# Altium schematic sheet Z7_ETHERNET.SchDoc
size A2
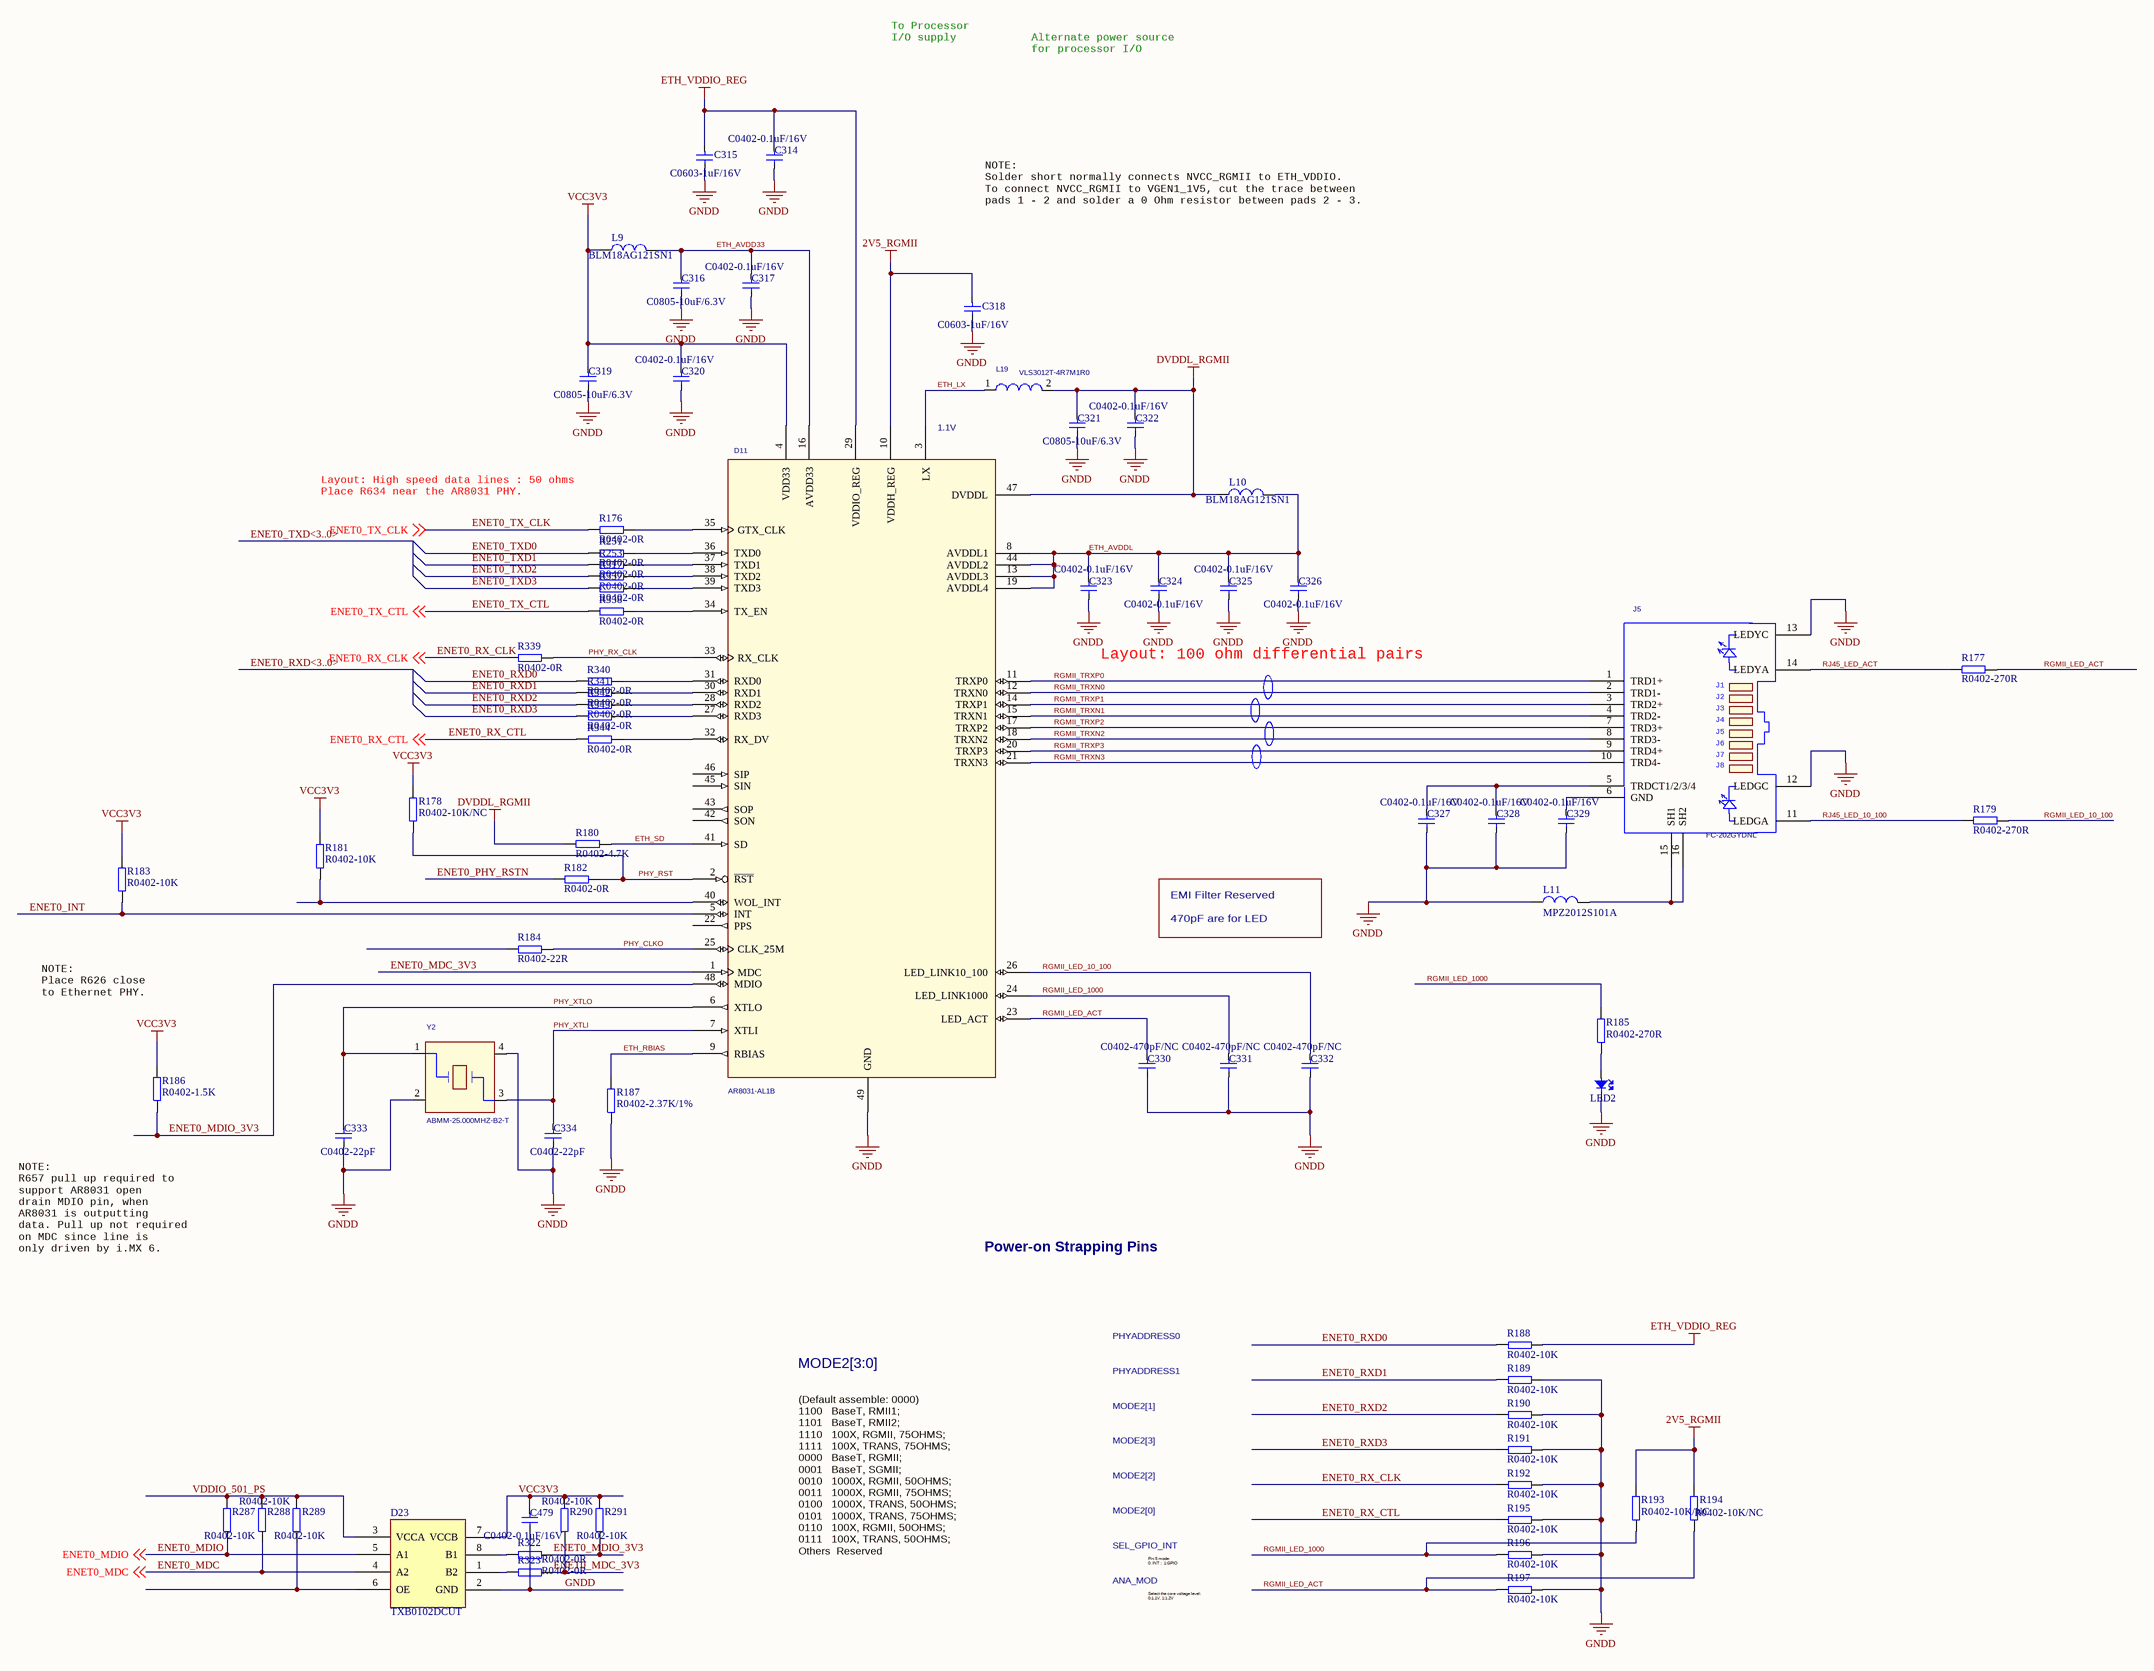
[diagram p0: Z7_ETHERNET.SchDoc]

## Parts
C314  C0402-0.1uF/16V  [C0402]
C315  C0603-1uF/16V  [C0603]
C316  C0805-10uF/6.3V  [C0805]
C317  C0402-0.1uF/16V  [C0402]
C318  C0603-1uF/16V  [C0603]
C319  C0805-10uF/6.3V  [C0805]
C320  C0402-0.1uF/16V  [C0402]
C321  C0805-10uF/6.3V  [C0805]
C322  C0402-0.1uF/16V  [C0402]
C323  C0402-0.1uF/16V  [C0402]
C324  C0402-0.1uF/16V  [C0402]
C325  C0402-0.1uF/16V  [C0402]
C326  C0402-0.1uF/16V  [C0402]
C327  C0402-0.1uF/16V  [C0402]
C328  C0402-0.1uF/16V  [C0402]
C329  C0402-0.1uF/16V  [C0402]
C330  C0402-470pF/NC  [C0402]
C331  C0402-470pF/NC  [C0402]
C332  C0402-470pF/NC  [C0402]
C333  C0402-22pF  [C0402]
C334  C0402-22pF  [C0402]
C479  C0402-0.1uF/16V  [C0402]
D11  AR8031-AL1B  [QFN-48N]
D23  TXB0102DCUT  [MSOP-8]
J5  FC-202GYDNL  [RJ45-1840710]
L9  BLM18AG121SN1  [R0603]
L10  BLM18AG121SN1  [R0603]
L11  MPZ2012S101A  [R0805]
L19  VLS3012T-4R7M1R0  [GTSD32P]
LED2  LED0603-GREEN  [LED-R0603]  (value not drawn)
R176  R0402-0R  [R0402]
R177  R0402-270R  [R0402]
R178  R0402-10K/NC  [R0402]
R179  R0402-270R  [R0402]
R180  R0402-4.7K  [R0402]
R181  R0402-10K  [R0402]
R182  R0402-0R  [R0402]
R183  R0402-10K  [R0402]
R184  R0402-22R  [R0402]
R185  R0402-270R  [R0402]
R186  R0402-1.5K  [R0402]
R187  R0402-2.37K/1%  [R0402]
R188  R0402-10K  [R0402]
R189  R0402-10K  [R0402]
R190  R0402-10K  [R0402]
R191  R0402-10K  [R0402]
R192  R0402-10K  [R0402]
R193  R0402-10K/NC  [R0402]
R194  R0402-10K/NC  [R0402]
R195  R0402-10K  [R0402]
R196  R0402-10K  [R0402]
R197  R0402-10K  [R0402]
R251  R0402-0R  [R0402]
R253  R0402-0R  [R0402]
R287  R0402-10K  [R0402]
R288  R0402-10K  [R0402]
R289  R0402-10K  [R0402]
R290  R0402-10K  [R0402]
R291  R0402-10K  [R0402]
R317  R0402-0R  [R0402]
R322  R0402-0R  [R0402]
R323  R0402-0R  [R0402]
R337  R0402-0R  [R0402]
R338  R0402-0R  [R0402]
R339  R0402-0R  [R0402]
R340  R0402-0R  [R0402]
R341  R0402-0R  [R0402]
R342  R0402-0R  [R0402]
R343  R0402-0R  [R0402]
R344  R0402-0R  [R0402]
Y2  ABMM-25.000MHZ-B2-T  [OSC3225-4P]

## Nets
2V5_RGMII: C318.1 D11.10(VDDH_REG) R193.2 R194.2
DVDDL_RGMII: C321.1 C322.1 D11.47(DVDDL) L10.1 L19.2 R180.2
ETH_VDDIO_REG: C314.1 C315.1 D11.29(VDDIO_REG) R188.2
GNDD: C314.2 C315.2 C316.2 C317.2 C318.2 C319.2 C320.2 C321.2 C322.2 C323.2 C324.2 C325.2 C326.2 C327.2 C328.2 C329.2 C330.2 C331.2 C332.2 C333.2 C334.2 C479.2 D11.49(GND) D23.2(GND) J5.12(LEDGC) J5.13(LEDYC) L11.1 LED2.2(K) R187.1 R189.2 R190.2 R191.2 R192.2 R195.2 R196.2 R197.2 Y2.2 Y2.4
VCC3V3: C319.1 C320.1 C479.1 D11.4(VDD33) D23.7(VCCB) L9.1 R178.2 R181.2 R183.2 R186.2 R290.2 R291.2
ENET0_INT: D11.5(INT) R183.1
ENET0_MDC: D23.4(A2) R288.1 ; off-sheet ENET0_MDC
ENET0_MDC_3V3: D11.1(MDC) R290.1 R323.2
ENET0_MDIO: D23.5(A1) R287.1 ; off-sheet ENET0_MDIO
ENET0_MDIO_3V3: D11.48(MDIO) R186.1 R291.1 R322.2
ENET0_PHY_RSTN: R182.1
ENET0_RX_CLK: R192.1 R339.1 ; off-sheet ENET0_RX_CLK
ENET0_RX_CTL: R195.1 R344.1 ; off-sheet ENET0_RX_CTL
ENET0_RXD0: R188.1 R340.1
ENET0_RXD1: R189.1 R341.1
ENET0_RXD2: R190.1 R342.1
ENET0_RXD3: R191.1 R343.1
ENET0_TX_CLK: R176.1 ; off-sheet ENET0_TX_CLK
ENET0_TX_CTL: R338.1 ; off-sheet ENET0_TX_CTL
ENET0_TXD0: R251.1
ENET0_TXD1: R253.1
ENET0_TXD2: R317.1
ENET0_TXD3: R337.1
ETH_AVDD33: C316.1 C317.1 D11.16(AVDD33) L9.2
ETH_AVDDL: C323.1 C324.1 C325.1 C326.1 D11.8(AVDDL1) D11.13(AVDDL3) D11.19(AVDDL4) D11.44(AVDDL2) L10.2
ETH_LX: D11.3(LX) L19.1
ETH_RBIAS: D11.9(RBIAS) R187.2
ETH_SD: D11.41(SD) R180.1
PHY_CLKO: D11.25(CLK_25M) R184.2
PHY_RST: D11.2(~{RST}) R178.1 R182.2
PHY_RX_CLK: D11.33(RX_CLK) R339.2
PHY_XTLI: C334.1 D11.7(XTLI) Y2.3
PHY_XTLO: C333.1 D11.6(XTLO) Y2.1
RGMII_LED_10_100: C332.1 D11.26(LED_LINK10_100) R179.1
RGMII_LED_1000: C331.1 D11.24(LED_LINK1000) R185.2 R193.1 R196.1
RGMII_LED_ACT: C330.1 D11.23(LED_ACT) R177.1 R194.1 R197.1
RGMII_TRXN0: D11.12(TRXN0) J5.2(TRD1-)
RGMII_TRXN1: D11.15(TRXN1) J5.4(TRD2-)
RGMII_TRXN2: D11.18(TRXN2) J5.8(TRD3-)
RGMII_TRXN3: D11.21(TRXN3) J5.10(TRD4-)
RGMII_TRXP0: D11.11(TRXP0) J5.1(TRD1+)
RGMII_TRXP1: D11.14(TRXP1) J5.3(TRD2+)
RGMII_TRXP2: D11.17(TRXP2) J5.7(TRD3+)
RGMII_TRXP3: D11.20(TRXP3) J5.9(TRD4+)
RJ45_LED_10_100: J5.11(LEDGA) R179.2
RJ45_LED_ACT: J5.14(LEDYA) R177.2
VDDIO_501_PS: D23.3(VCCA) R287.2 R288.2 R289.2
NetC327_1: C327.1 C328.1 J5.5(TRDCT1/2/3/4)
NetC329_1: C329.1 J5.6(GND)
NetD11_27: D11.27(RXD3) R343.2
NetD11_28: D11.28(RXD2) R342.2
NetD11_30: D11.30(RXD1) R341.2
NetD11_31: D11.31(RXD0) R340.2
NetD11_32: D11.32(RX_DV) R344.2
NetD11_34: D11.34(TX_EN) R338.2
NetD11_35: D11.35(GTX_CLK) R176.2
NetD11_36: D11.36(TXD0) R251.2
NetD11_37: D11.37(TXD1) R253.2
NetD11_38: D11.38(TXD2) R317.2
NetD11_39: D11.39(TXD3) R337.2
NetD11_40: D11.40(WOL_INT) R181.1
NetD23_1: D23.1(B2) R323.1
NetD23_6: D23.6(OE) R289.1
NetD23_8: D23.8(B1) R322.1
NetJ5_15: J5.15(SH1) J5.16(SH2) L11.2
NetLED2_1: LED2.1(A) R185.1

Not connected (* = marked no-connect by the designer): D11 22(PPS) 42(SON) 43(SOP) 45(SIN) 46(SIP); R184 1

## Buses and harness runs
bus ENET0_RXD<3..0>
bus ENET0_TXD<3..0>

## Notes on the sheet
- To Processor
  I/O supply
- Alternate power source
  for processor I/O
- NOTE:
  Solder short normally connects NVCC_RGMII to ETH_VDDIO.
  To connect NVCC_RGMII to VGEN1_1V5, cut the trace between
  pads 1 - 2 and solder a 0 Ohm resistor between pads 2 - 3.
- (near D11) 1.1V
- Layout: High speed data lines : 50 ohms
  Place R634 near the AR8031 PHY.
- Layout: 100 ohm differential pairs
- 470pF are for LED
- EMI Filter Reserved
- NOTE:
  Place R626 close
  to Ethernet PHY.
- NOTE:
  R657 pull up required to
  support AR8031 open
  drain MDIO pin, when
  AR8031 is outputting
  data. Pull up not required
  on MDC since line is
  only driven by i.MX 6.
- Power-on Strapping Pins
- PHYADDRESS0
- MODE2[3:0]
- PHYADDRESS1
- MODE2[3]
- MODE2[1]
- MODE2[2]
- MODE2[0]
- SEL_GPIO_INT
- Pin 5 mode:
  0: INT ;  1:GPIO
- (Default assemble: 0000)
  1100   BaseT, RMII1;
  1101   BaseT, RMII2;
  1110   100X, RGMII, 75OHMS;
  1111   100X, TRANS, 75OHMS;
  0000   BaseT, RGMII;
  0001   BaseT, SGMII;
  0010   1000X, RGMII, 50OHMS;
  0011   1000X, RGMII, 75OHMS;
  0100   1000X, TRANS, 50OHMS;
  0101   1000X, TRANS, 75OHMS;
  0110   100X, RGMII, 50OHMS;
  0111   100X, TRANS, 50OHMS;
  Others  Reserved
- ANA_MOD
- Select the core voltage level:
  0:1.1V, 1:1.2V
- (in symbol V890-1AX1-A1_2) J1; J2; J3; J4; J6; J7; J8

## Library data of the parts
C314 C317 C320 C322-C334 C479 = C0402-0.1uF/16V: X7R; Manufacturer: SAMSUNG; Manufacturer_p/n: CL05X7R104KO5NNN; Part_type: CAP; temperature: -55℃\+125℃; Schematic_Part: CAP; PCB_Footprint: C0402; datasheet: #DataSheet\C_Samsung_General Capacitors.pdf#
  C314 C317 C320 C322-C329 C479: Part_number: C0402-0.1uF/16V; Value: C0402-0.1uF/16V
  C330-C332: Part_number: C0402-470pF/NC; Value: C0402-470pF/NC
  C333 C334: Part_number: C0402-22pF; Value: C0402-22pF
C315 C318 = C0603-100nF/16V: X7R; Part_number: C0603-1uF/16V; Part_type: CAP; Value: C0603-1uF/16V; temperature: -55℃\+125℃; Schematic_Part: CAP; PCB_Footprint: C0603
C316 C319 C321 = C1210-22uF/16V: Part_number: C0805-10uF/6.3V; Part_type: CAP; Value: C0805-10uF/6.3V; Schematic_Part: CAP; PCB_Footprint: C0805
D11 = AR8031_QFN48: IC XCVR ETHERNET PHY 10/100/1000G-BIT 3.3V QFN48; AGILE_PN: 312-80115; MFG_NAME01: Atheros Communications, Inc; CAD_APPROVED: Yes; CLASS: IC; MFG_PN01: AR8031-AL1B; ROHS: Yes; HEIGHT: 0.8MM
D23 = TXB0102: Part_number: TXB0102DCUT
J5 = V890-1AX1-A1_2: CON 10 RJ-45 SHLD TH G/Y LEDS 50MIL SP 662H AU 125L; CLASS: IO; CAD_APPROVED: Yes; MFG_NAME01: BEL FUSE; AGILE_PN: 210-79982; HEIGHT: 16.814MM; ROHS: Yes; MFG_PN01: FC-202GYDNL
L9 L10 = FB0805-330R@100MHz: Manufacturer: 村田; Part_number: BLM18AG121SN1; Part_type: BEAD; temperature: -55℃\+125℃; Value1: 330R@100MHz; Schematic_Part: BEAD; PCB_Footprint: R0603; Manufacturer_p/n: BLM18AG121SN1
L11 = FB0805-330R@100MHz: Manufacturer: TDK; Part_number: MPZ2012S101A; Part_type: BEAD; temperature: -55℃\+125℃; Value1: 330R@100MHz; Schematic_Part: BEAD; PCB_Footprint: R0805; Manufacturer_p/n: MPZ2012S101A
L19 = INDUCTOR_0: IND PWR 4.7UH@1MHZ 1A 20% SMD; PART_TYPE: INDUCTOR\POWER; CLASS: DISCRETE; ROOM: RGMII_PHY; AGILE_PN: 180-77706; MFG_NAME01: TDK; CAD_APPROVED: Yes; PRIORITY_PN: 024-00152; SIGNAL_MODEL: DEFAULT_INDUCTOR_4700nH_2_1; Tolerance: 20%; MFG_PN01: VLS3012T-4R7M1R0; ROHS: Yes; HEIGHT: 1.2MM
LED2 = LED-R_3: 表贴发光二极管, 0603封装, 体积1.6x0.8mm, 绿色, 高度0.8mm; Part_number: LED0603-GREEN
R176-R197 R251 R253 R287-R291 R317 R322 R323 R337-R344 = R0402-10K: Manufacturer: SAMSUNG; Part_type: RES; Schematic_Part: RES; PCB_Footprint: R0402
  R176 R182 R251 R253 R317 R322 R323 R337-R344: Part_number: R0402-0R; Value: R0402-0R
  R177 R179 R185: Part_number: R0402-270R; Value: R0402-270R
  R178 R193 R194: Part_number: R0402-10K/NC; Value: R0402-10K/NC
  R180: Part_number: R0402-4.7K; Value: R0402-4.7K
  R181 R183 R188-R192 R195-R197 R287-R291: Part_number: R0402-10K; Value: R0402-10K
  R184: Part_number: R0402-22R; Value: R0402-22R
  R186: Part_number: R0402-1.5K; Value: R0402-1.5K
  R187: Part_number: R0402-2.37K/1%; Value: R0402-2.37K/1%
Y2 = XTAL_13Y: XTAL 25MHZ -- -- SMT; CLASS: IC; CAD_APPROVED: Yes; MFG_NAME01: ABRACON CORP; AGILE_PN: 230-77853; HEIGHT: 1.3MM; ROHS: Yes; MFG_PN01: ABMM-25.000MHZ-B2-T